# EAGLE design IntelliServo (EAGLE 7.5.0)
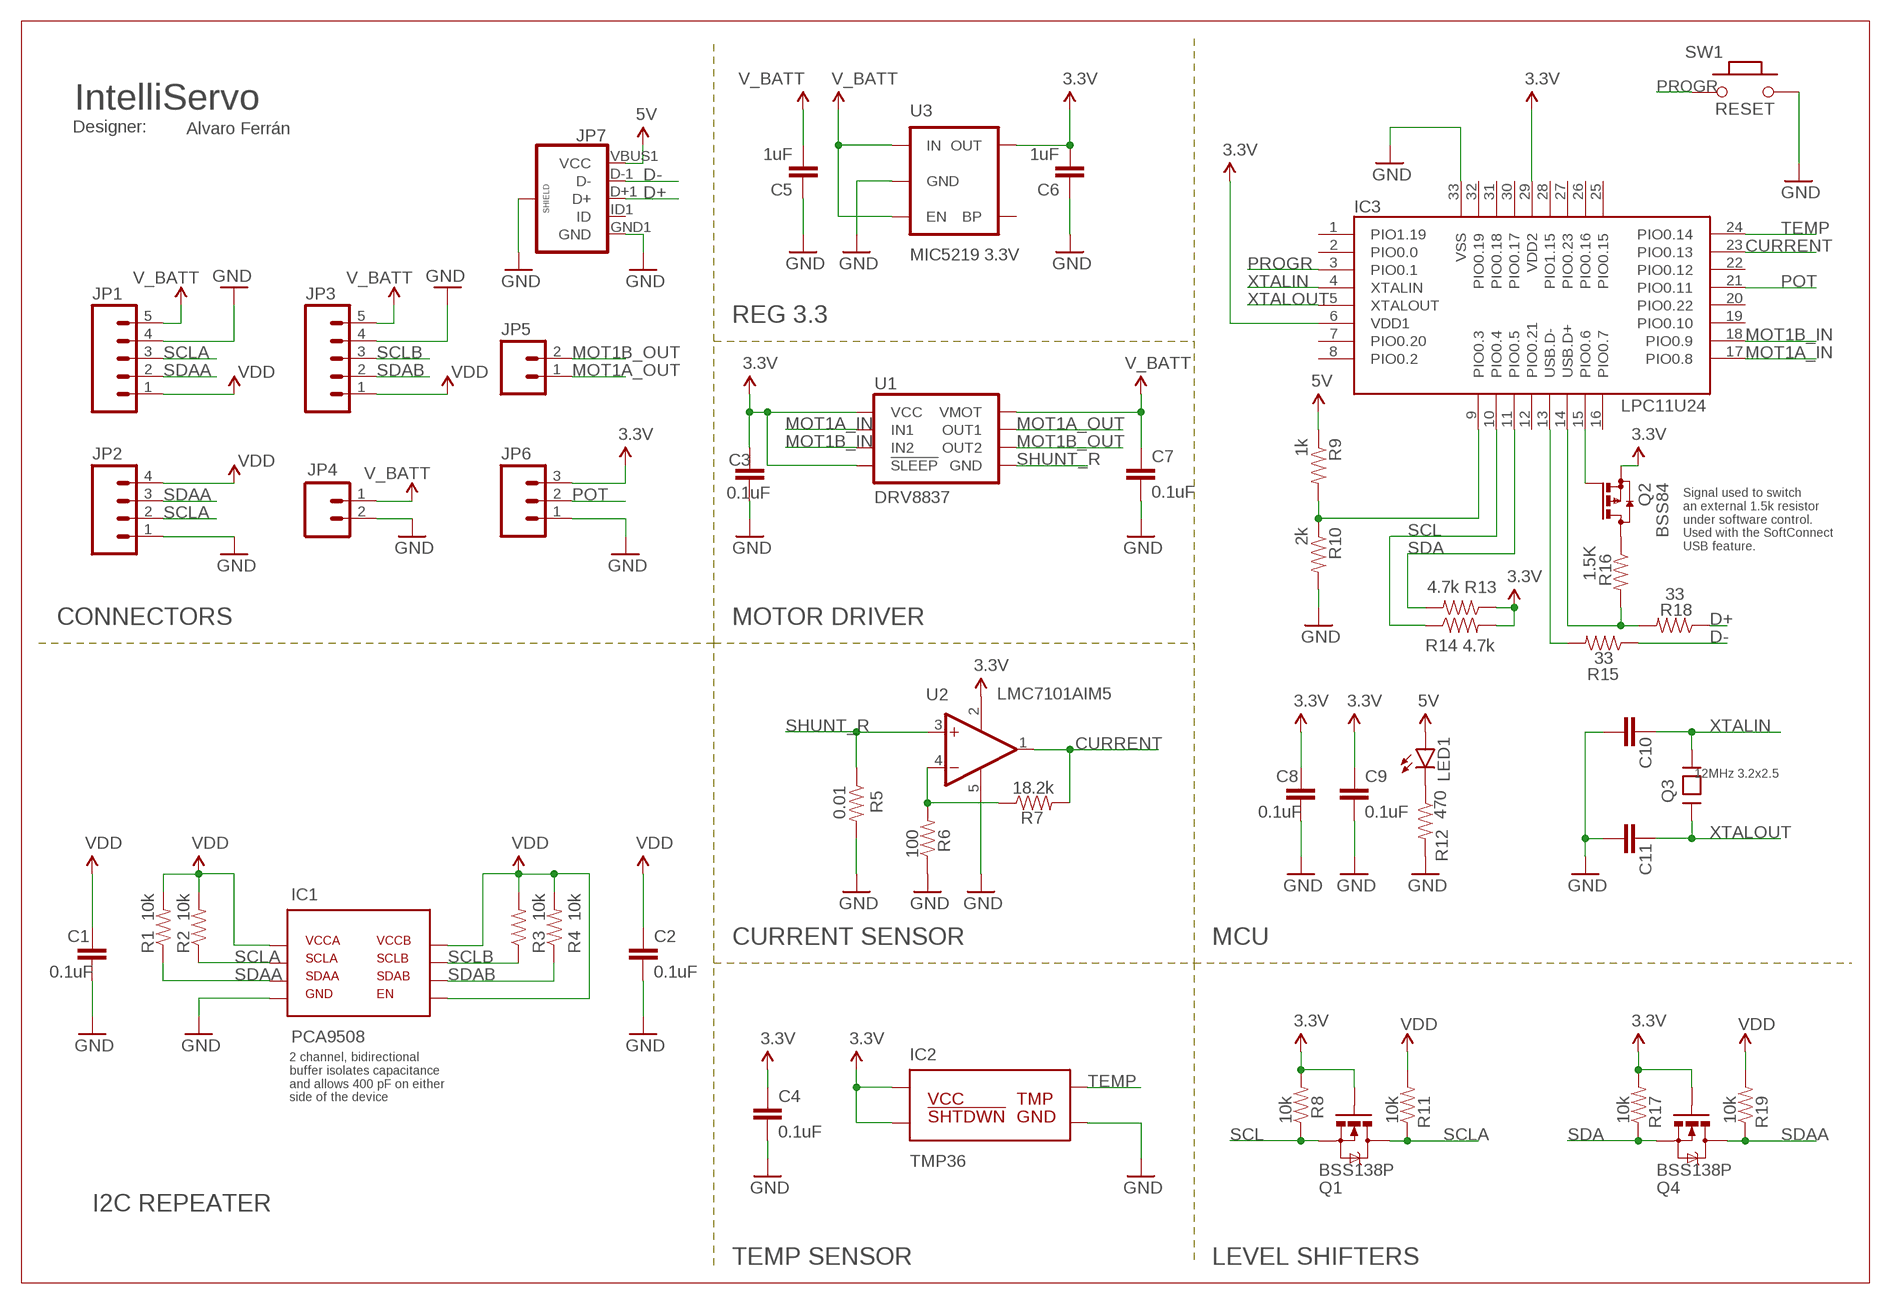
[diagram p0: schematic, sheet 1]

## Parts
C1  0.1uF  CAP0402-CAP  [0402-CAP]
C2  0.1uF  CAP0402-CAP  [0402-CAP]
C3  0.1uF  0.1UF-16V(+-10%)(0402)  [0402-CAP]
C4  0.1uF  CAP0402-CAP  [0402-CAP]
C5  1uF  CAP0402-CAP  [0402-CAP]
C6  1uF  CAP0402-CAP  [0402-CAP]
C7  0.1uF  0.1UF-16V(+-10%)(0402)  [0402-CAP]
C8  0.1uF  CAP0402-CAP  [0402-CAP]
C9  0.1uF  CAP0402-CAP  [0402-CAP]
C10  27pF  CAP0402-CAP  [0402-CAP]
C11  27pF  CAP0402-CAP  [0402-CAP]
IC1  PCA9508  [TSSOP8]
IC2  TMP36  [SOT23-5]
IC3  LPC11U24  LPC11U2X_HVQFN33(5X5)  [HVQFN33_5X5MM]
JP1  M05LOCK  [1X05_LOCK]
JP2  M04LOCK  [1X04_LOCK]
JP3  M05LOCK  [1X05_LOCK]
JP4  M02LOCK  [1X02_LOCK]
JP5  M02LOCK  [1X02_LOCK]
JP6  M03LOCK  [1X03_LOCK]
JP7  USB_MICROB  USB_MICROB_PLUGCONN-11752  [USB-B-MICRO-SMD_V03]
LED1  LED0603  [LED-0603]
Q1  BSS138P  MOSFET-NCHANNELBSS138  [SOT23-3]
Q2  BSS84  [SOT23]
Q3  12MHz 3.2x2.5  CRYSTAL3.2X2.5  [CRYSTAL_3.2X2.5]
Q4  BSS138P  MOSFET-NCHANNELBSS138  [SOT23-3]
R1  10k  RESISTOR0402-RES  [0402-RES]
R2  10k  RESISTOR0402-RES  [0402-RES]
R3  10k  RESISTOR0402-RES  [0402-RES]
R4  10k  RESISTOR0402-RES  [0402-RES]
R5  0.01  RESISTOR0805-RES  [0805]
R6  100  RESISTOR0402-RES  [0402-RES]
R7  18.2k  RESISTOR0402-RES  [0402-RES]
R8  10k  RESISTOR0402-RES  [0402-RES]
R9  1k  RESISTOR0402-RES  [0402-RES]
R10  2k  RESISTOR0402-RES  [0402-RES]
R11  10k  RESISTOR0402-RES  [0402-RES]
R12  470  RESISTOR0402-RES  [0402-RES]
R13  4.7k  RESISTOR0402-RES  [0402-RES]
R14  4.7k  RESISTOR0402-RES  [0402-RES]
R15  33  RESISTOR0402-RES  [0402-RES]
R16  1.5K  RESISTOR0402-RES  [0402-RES]
R17  10k  RESISTOR0402-RES  [0402-RES]
R18  33  RESISTOR0402-RES  [0402-RES]
R19  10k  RESISTOR0402-RES  [0402-RES]
SW1  RESET  PB157  [157SW]
U1  DRV8837  [DSG]
U2  LMC7101AIM5  [SOT23-5]
U3  MIC5219 3.3V  V_REG_MIC52193.3V  [SOT23-5]

## Nets
3.3V: C3.1 C4.1 C6.2 C8.1 C9.1 IC2.2(VCC) IC2.4(!SHTDWN) IC3.6(VDD1) IC3.29(VDD2) JP6.3 Q1.1(G) Q2.2(S) Q4.1(G) R8.2 R13.1 R14.2 R17.2 U1.7(!SLEEP) U1.8(VCC) U2.2(V+) U3.5(OUT)
5V: JP7.VBUS1(VCC) LED1.A R9.1
CURRENT: IC3.23(PIO0.13) R7.2 U2.1(OUT)
D+: JP7.D+1(D+) R18.1
D-: JP7.D-1(D-) R15.1
GND: C1.2 C2.2 C3.2 C4.2 C5.1 C6.1 C7.2 C8.2 C9.2 C10.2 C11.2 IC1.4(GND) IC2.5(GND) IC3.33(VSS) JP1.4 JP2.1 JP3.4 JP4.2 JP6.1 JP7.GND1(GND) JP7.SHIELD1(SHIELD) JP7.SHIELD2(SHIELD) JP7.SHIELD3(SHIELD) R5.2 R6.1 R10.2 R12.2 SW1.2 U2.5(V-) U3.2(GND)
MOT1A_IN: IC3.17(PIO0.8) U1.6(IN1)
MOT1A_OUT: JP5.1 U1.2(OUT1)
MOT1B_IN: IC3.18(PIO0.9) U1.5(IN2)
MOT1B_OUT: JP5.2 U1.3(OUT2)
N$2: LED1.C R12.1
N$4: R6.2 R7.1 U2.4(-IN)
N$27: IC3.14(USB.D+) R16.2 R18.2
N$29: IC3.13(USB.D-) R15.2
N$30: Q2.3(D) R16.1
N$31: IC3.15(PIO0.6) Q2.1(G)
P0.3/ISP_COMMAND_USB_HIGH: IC3.9(PIO0.3) R9.2 R10.1
POT: IC3.21(PIO0.11) JP6.2
PROGR: IC3.3(PIO0.1) SW1.1
SCL: IC3.10(PIO0.4) Q1.2(S) R8.1 R14.1
SCLA: IC1.2(SCLA) JP1.3 JP2.2 Q1.3(D) R2.1 R11.1
SCLB: IC1.7(SCLB) JP3.3 R3.1
SDA: IC3.11(PIO0.5) Q4.2(S) R13.2 R17.1
SDAA: IC1.3(SDAA) JP1.2 JP2.3 Q4.3(D) R1.1 R19.1
SDAB: IC1.6(SDAB) JP3.2 R4.1
SHUNT_R: R5.1 U1.4(GND) U1.PAD(GND) U2.3(+IN)
TEMP: IC2.1(TMP) IC3.24(PIO0.14)
V_BATT: C5.2 C7.1 JP1.5 JP3.5 JP4.1 U1.1(VMOT) U3.1(IN) U3.3(EN)
VDD: C1.1 C2.1 IC1.1(VCCA) IC1.5(EN) IC1.8(VCCB) JP1.1 JP2.4 JP3.1 R1.2 R2.2 R3.2 R4.2 R11.2 R19.2
XTALIN: C10.1 IC3.4(XTALIN) Q3.3
XTALOUT: C11.1 IC3.5(XTALOUT) Q3.1
Unconnected: IC3.1(PIO1.19) IC3.2(PIO0.0) IC3.7(PIO0.20) IC3.8(PIO0.2) IC3.12(PIO0.21) IC3.16(PIO0.7) IC3.19(PIO0.10) IC3.20(PIO0.22) IC3.22(PIO0.12) IC3.25(PIO0.15) IC3.26(PIO0.16) IC3.27(PIO0.23) IC3.28(PIO1.15) IC3.30(PIO0.17) IC3.31(PIO0.18) IC3.32(PIO0.19) JP7.ID1(ID) U3.4(BP)

## Notes on the sheet
- IntelliServo
- Designer: | Alvaro Ferrán
- REG 3.3
- Signal used to switch
  an external 1.5k resistor
  under software control.
  Used with the SoftConnect
  USB feature.
- CONNECTORS | MOTOR DRIVER
- IC1
- CURRENT SENSOR | MCU
- PCA9508
- IC2
- 2 channel, bidirectional
  buffer isolates capacitance
  and allows 400 pF on either
  side of the device
- TMP36
- I2C REPEATER
- TEMP SENSOR | LEVEL SHIFTERS

## Library data of the parts
C1 C2 C4-C6 C8-C11 = SparkFun-Passives:CAP: Capacitor Standard 0603 ceramic capacitor, and 0.1" leaded capacitor.
C3 C7 = SparkFun-Capacitors:0.1UF-16V(+-10%)(0402); PROD_ID: CAP-12416
IC1 = alvaroferran:PCA9508: Level translating I2C-bus repeater. Connects A to B side, in regular i2c bus length intervals, indefinetely.
IC2 = alvaroferran:TMP36
IC3 = GHI-SoMs-Processors:LPC11U2X_HVQFN33(5X5)
JP1 JP3 = SparkFun-Connectors:M05: Header 5 Standard 5-pin 0.1" header. Use with straight break away headers (SKU : PRT-00116), right angle break away headers (PRT-00553), swiss pins (PRT-00743), machine pins (PRT-00117), and female headers (PRT-00115). Molex polarized connector foot print use with SKU : PRT-08230 with associated crimp pins and housings.
JP2 = SparkFun-Connectors:M04: Header 4 Standard 4-pin 0.1" header. Use with straight break away headers (SKU : PRT-00116), right angle break away headers (PRT-00553), swiss pins (PRT-00743), machine pins (PRT-00117), and female headers (PRT-00115). Molex polarized connector foot print use with SKU : PRT-08231 with associated crimp pins and housings. 1MM SMD Version SKU: PRT-10208
JP4 JP5 = SparkFun-Connectors:M02: Standard 2-pin 0.1" header. Use with - straight break away headers ( PRT-00116) - right angle break away headers (PRT-00553) - swiss pins (PRT-00743) - machine pins (PRT-00117) - female headers (PRT-00115) Molex polarized connector foot print use with: PRT-08233 with associated crimp pins and housings. 2.54_SCREWTERM for use with PRT-10571. 3.5mm Screw Terminal footprints for PRT-08084 5mm Screw Terminal footprints for use with PRT-08432
JP6 = SparkFun-Connectors:M03: Header 3 Standard 3-pin 0.1" header. Use with straight break away headers (SKU : PRT-00116), right angle break away headers (PRT-00553), swiss pins (PRT-00743), machine pins (PRT-00117), and female headers (PRT-00115). Molex polarized connector foot print use with SKU : PRT-08232 with associated crimp pins and housings.
JP7 = SparkFun-Connectors:USB_MICROB_PLUG: USB Micro-B connectors Some male, some female. Watch your step!; PROD_ID: CONN-11752
LED1 = SparkFun-LED:LED: LEDs Standard schematic elements and footprints for 5mm, 3mm, 1206, and 0603 sized LEDs. 5mm - Spark Fun Electronics SKU : COM-00529 (and others)
Q1 Q4 = SparkFun-DiscreteSemi:MOSFET-NCHANNEL: Common NMOSFET Parts MFG P/N Store ID Prod ID FDD8780 TRANS-09984 SI7820DN TRANS-11055 FDS6630A IC-08089 2N7002PW TRANS-11151 FQP30N06L COM-10213 TRANS-10060 BSS123LT1G TRANS-08345 BSS138 TRANS-00830 BS170 2N7000; PROD_ID: TRANS-00830; VALUE: 200mA/50V
Q2 = transistor-small-signal:BSS84: P-CHANNEL MOS FET
Q3 = GHI:CRYSTAL3.2X2.5
R1-R19 = SparkFun-Passives:RESISTOR: Resistor Basic schematic elements and footprints for 0603, 1206, and PTH resistors.
SW1 = MySMD:PB157
U1 = packages(ti):DRV8837
U2 = linear:LMC7101AIM5
U3 = SparkFun-PowerIC:V_REG_MIC5219: V_REG MIC5219 Standard 3.3V and 5V 500mA LDO voltage regulator in SOT-23 layout. Micrel part MIC5219. BP (by-pass) pin is used to lower output noise with 470pF cap, may be left open.; PROD_ID: VREG-09872

## Net classes
0 default: width 0.254 mm, drill 0.254 mm, clearance 0.203 mm

## Board
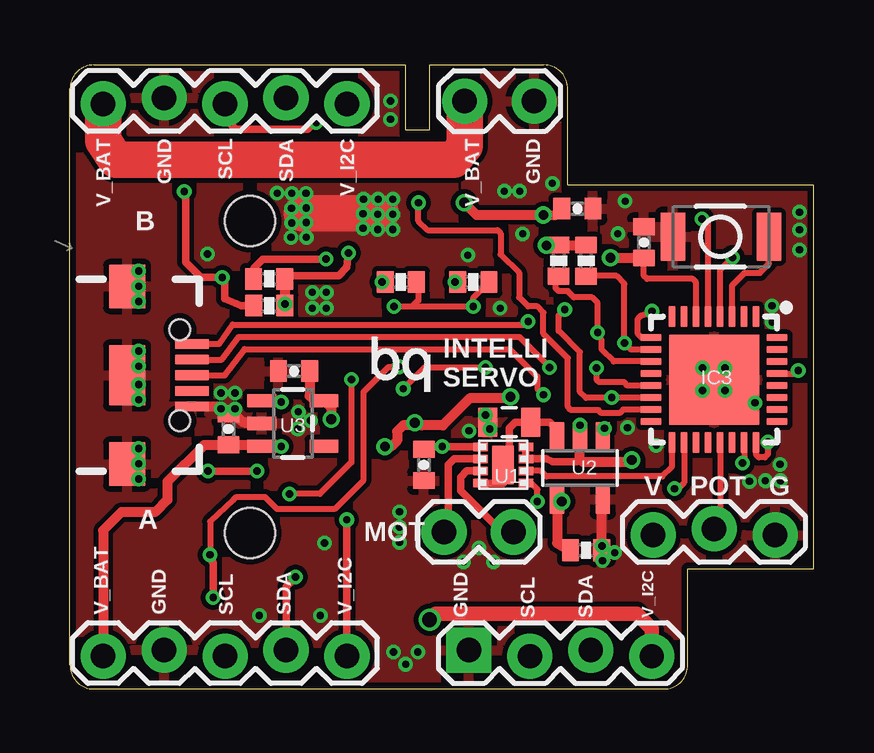
[diagram p1: board, top side]
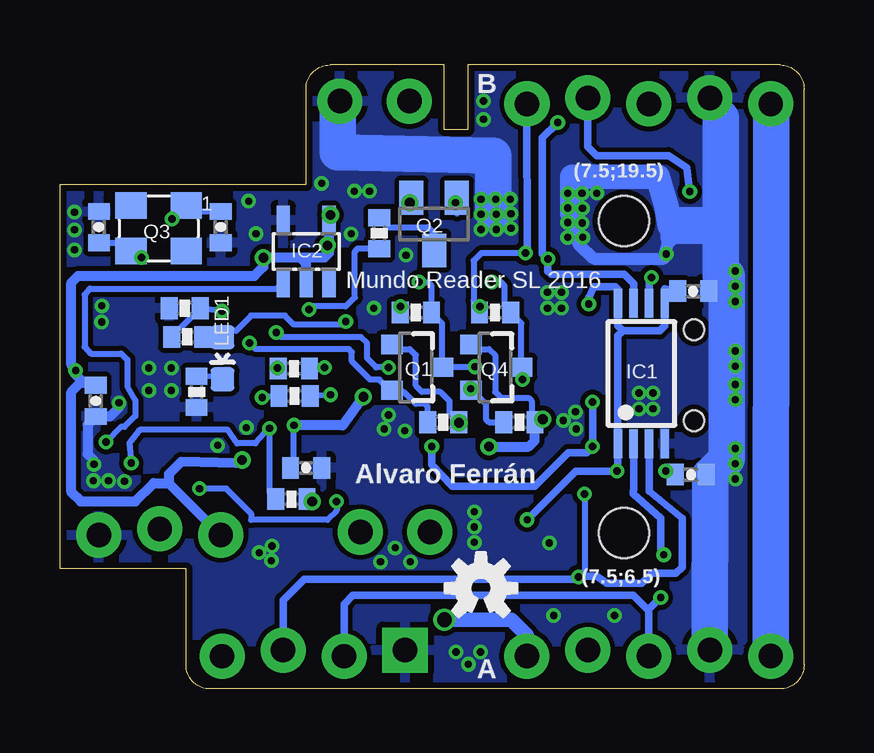
[diagram p2: board, bottom side, seen from below]

Size 31 x 26 mm. Coordinates in mm from the lower left corner, seen from the top.
Outline: 1,0 24.75,0 arc90 25.75,1 25.75,5 31,5 31,21 20.75,21 20.75,25 arc90 19.75,26 15,26 15,23.3 14,23.3 14,26 1,26 arc90 0,25 0,1 arc90 1,0
Copper layers (1*16): Top 0.035mm / dielectric 1.5mm / Bottom 0.035mm
Design rules "pighixxx_CAM_DRC_V1.0": minimum track width 6mil, minimum drill 12mil, track to track 6mil, track to pad 6mil, pad to pad 6mil, via to via 6mil, smd to smd 0mil, copper to edge 10mil, drill to drill 10mil, minimum pad ring 10mil, minimum via ring 6mil, stop-mask expansion 2mil, vias tented up to drill 100mil, thermal gap 10mil
Holes 2.1 mm at 7.5,19.5 7.5,6.5

### Footprints (pad centres in the part's own frame; a part is rotated, then mirrored left to right if it is on the bottom)
0402-CAP = smd 0.7 x 0.9: 1 -0.65,0; 2 0.65,0
TSSOP8 = smd 1.2 x 0.35: 1 -2.925,0.975; 2 -2.925,0.325; 3 -2.925,-0.325; 4 -2.925,-0.975; 5 2.925,-0.975; 6 2.925,-0.325; 7 2.925,0.325; 8 2.925,0.975
SOT23-5 = smd 0.55 x 1.2: 1 -0.95,-1.3; 2 0,-1.3; 3 0.95,-1.3; 4 0.95,1.3; 5 -0.95,1.3
HVQFN33_5X5MM = smd 0.85 x 0.27: 1 -2.625,1.75; 2 -2.625,1.25; 3 -2.625,0.75; 4 -2.625,0.25; 5 -2.625,-0.25; 6 -2.625,-0.75; 7 -2.625,-1.25; 8 -2.625,-1.75; 17 2.625,-1.75; 18 2.625,-1.25; 19 2.625,-0.75; 20 2.625,-0.25; 21 2.625,0.25; 22 2.625,0.75; 23 2.625,1.25; 24 2.625,1.75 | smd 0.27 x 0.85: 9 -1.75,-2.625; 10 -1.25,-2.625; 11 -0.75,-2.625; 12 -0.25,-2.625; 13 0.25,-2.625; 14 0.75,-2.625; 15 1.25,-2.625; 16 1.75,-2.625; 25 1.75,2.625; 26 1.25,2.625; 27 0.75,2.625; 28 0.25,2.625; 29 -0.25,2.625; 30 -0.75,2.625; 31 -1.25,2.625; 32 -1.75,2.625 | smd 3.75 x 3.75: 33 0,0
1X05_LOCK = drill 1.016 pad 1.88: 1 0,0.127; 2 2.54,-0.127; 3 5.08,0.127; 4 7.62,-0.127; 5 10.16,0.127
1X04_LOCK = drill 1.016 pad 1.88 square: 1 0,0.127 | drill 1.016 pad 1.88: 2 2.54,-0.127; 3 5.08,0.127; 4 7.62,-0.127
1X02_LOCK = drill 1.016 pad 1.88: 1 -0.178,0; 2 2.718,0
1X03_LOCK = drill 1.016 pad 1.88: 1 0,0.127; 2 2.54,-0.127; 3 5.08,0.127
USB-B-MICRO-SMD_V03 = smd 1.4 x 0.4: D+1 2.7,0; D-1 2.7,0.65; GND1 2.7,-1.3; ID1 2.7,-0.65; VBUS1 2.7,1.3 | smd 1.5 x 1.8: SHIELD1 0,3.7; SHIELD2 0,-3.7 | smd 1.5 x 2.5: SHIELD3 0,0 | hole 0.85: 2.2,1.9; 2.2,-1.9
LED-0603 = smd 1 x 1: A 0,-0.877; C 0,0.877
SOT23-3 = smd 0.8 x 0.9: 1 -0.95,-1; 2 0.95,-1; 3 0,1.1
SOT23 = smd 1 x 1.4: 1 -0.95,-1.1; 2 0.95,-1.1; 3 0,1.1
CRYSTAL_3.2X2.5 = smd 1.3 x 1.1: 1 -1.1,-0.9; 2 1.2,-0.9; 3 1.2,1; 4 -1.1,1
0402-RES = smd 0.7 x 0.9: 1 -0.65,0; 2 0.65,0
0805 = smd 0.8 x 1.2: 1 -0.9,0; 2 0.9,0
157SW = smd 1.016 x 1.981: 1 0,0; 2 4,0
DSG = smd 0.6 x 0.35: 1 -0.95,0.75; 2 -0.95,0.25; 3 -0.95,-0.25; 4 -0.95,-0.75; 5 0.95,-0.75; 6 0.95,-0.25; 7 0.95,0.25; 8 0.95,0.75 | smd 0.9 x 1.6: PAD 0,0
SOT23-5' = smd 0.6 x 1.2: 1 -0.95,-1.306; 2 0,-1.306; 3 0.95,-1.306; 4 0.95,1.306; 5 -0.95,1.306

### Placement (x,y rotation side)
C1  4.62,16.57 0 bottom
C2  4.72,8.93 0 bottom
C3  20.75,9.21 0 bottom
C4  21.15,20.01 0 top
C5  6.6,10.82 270 top
C6  9.34,13.25 0 top
C7  14.75,9.33 270 top
C8  23.92,18.61 90 top
C9  29.51,12 270 bottom
C10  29.38,19.24 90 bottom
C11  24.3,19.24 270 bottom
IC1  6.78,13.14 90 bottom
IC2  20.75,18.22 0 bottom
IC3  26.84,12.89 270 top
JP1  11.54,1.5 180 top
JP2  16.62,1.49 0 top
JP3  11.54,24.5 180 top
JP4  16.62,24.49 0 top
JP5  15.77,6.54 0 top
JP6  29.38,6.54 180 top
JP7  2.38,13.07 0 top
LED1  24.23,13.78 180 bottom
Q1  16.17,13.4 270 bottom
Q2  15.41,19.37 180 bottom
Q3  26.84,19.24 180 bottom
Q4  12.87,13.4 270 bottom
R1  13.79,16.95 0 top
R2  16.81,16.95 0 top
R3  8.3,17.08 0 top
R4  8.31,15.97 0 top
R5  18.31,11.11 180 top
R6  21.51,5.78 180 top
R7  21.36,7.91 180 bottom
R8  15.03,11.11 0 bottom
R9  25.7,14.67 180 bottom
R10  25.8,15.86 180 bottom
R11  16.17,15.68 180 bottom
R12  25.31,12.38 270 bottom
R13  20.36,17.84 270 top
R14  21.51,17.84 90 top
R15  21.25,13.35 180 bottom
R16  17.7,18.99 270 bottom
R17  11.86,11.11 0 bottom
R18  21.23,12.2 180 bottom
R19  12.87,15.68 180 bottom
SW1  29.13,18.84 180 top
U1  18.05,9.33 0 top
U2  LMC7101AIM5  [SOT23-5']  21.25,9.21 180 top
U3  9.29,11.06 270 top
U$1  [BQ_LOGO_SMALL_1]  13.76,12.89 0 top
U$2  [OSHW-LOGO-S]  13.46,4.19 0 bottom

### Tracks (layer width: path | path; a pad name or v marks a point on that pad's centre or on a via)
3.3V  (via drill 0.3, 0.41)
  Top 0.254: IC3.6 26.09,16.94 25.95,17.08 24.05,17.08 23.92,17.21 C8.1 | v14.37,11.09 14.47,10.98 14.65,10.98 | IC3.29 30.27,13.14 v30.35,13.27
  Top 0.305: U1.8 U1.7 19.86,9.59 20.11,9.46 21.13,9.46 21.25,9.59 21.38,9.46
  Top 0.406: C6.2 9.99,12.21 10.22,11.99 U3.5 | 21.38,9.46 23.16,9.46 v23.41,9.54 | v21.25,10.98 U2.2 21.25,9.59 | 10.63,12 U3.5 | v18.36,12.18 18.2,12.13 16.68,12.13 15.54,10.98 14.65,10.98 13.89,10.98 13.63,10.73 13.63,10.35 13.38,10.1 v13.12,10.1 | U3.5 10.89,11.71 v10.89,11.24 | v22.52,17.97 22.54,17.95 C8.1 | C4.1 20.23,19.74 v19.73,19.75 16.93,19.75 v16.43,20.26 | R14.2 R13.1 v19.86,18.48
  Bottom 0.254: 16.98,14.16 16.43,14.16 16.17,13.91 16.17,12.64 15.92,12.38 15.16,12.38 14.78,12 14.78,11.51 R8.2 | 13.68,14.16 13.12,14.16 12.87,13.91 12.87,12.38 12.62,12.13 11.47,12.13 11.35,12 11.35,11.25 R17.2 | v30.35,13.27 30.5,13.27 30.52,13.5 | Q2.2 16.43,20.4 v16.43,20.26 | C3.1 21.25,9.35 v21.25,10.98
  Bottom 0.406: Q1.1 16.98,14.16 | Q4.1 13.68,14.16 | v23.41,9.54 23.67,9.41 25.95,9.46 26.46,8.95 26.46,8.57 | JP6.3 26.46,8.57 | v18.36,12.18 19.22,10.98 v21.25,10.98 | v10.89,11.24 11.02,11.11 R17.2 11.22,11.1 11.22,10.35 11.47,10.1 v13.12,10.1 | v14.37,11.09 R8.2 | IC2.2 20.75,17.72 21,17.97 | 21,17.97 v22.52,17.97 22.52,17.59 22.9,17.21 30.25,17.21 30.52,16.93 30.52,13.5 v30.35,13.27 30.4,13.14 30.02,12.76 29.4,12.76 C9.1 30.13,12.78 30.52,12.38 30.52,8.19 30.14,7.81 27.86,7.81 27.09,8.57 26.46,8.57 | 19.8,18.73 IC2.4 19.8,19.68 v19.73,19.75 | 19.8,18.73 19.8,18.16 19.98,17.97 21,17.97 | v19.86,18.48 19.8,18.73
5V  (via drill 0.3)
  Top 0.254: JP7.VBUS1 6.22,14.37 6.78,15.18 18.97,15.18 v19.09,15.3
  Bottom 0.254: v19.09,15.3 19.22,15.18 21.25,15.18 21.63,15.56 23.03,15.56 23.67,14.92 24.68,14.92 25.19,14.41 R9.1 24.95,14.41 LED1.A
CURRENT  (via drill 0.3)
  Top 0.254: IC3.23 28.09,9.61 28.11,9.59 v28.03,9.42
  Top 0.406: v22.27,10.86 22.27,10.45 U2.1
  Bottom 0.254: R7.2 22.27,8.18 v22.27,10.86 22.46,10.67 22.86,10.24 23.62,10.24 24,10.79 27.69,10.79 28.11,10.24 v28.03,9.42
D+  (via drill 0.3)
  Top 0.254: JP7.D+1 6.45,13.07 7.28,14.16 18.33,14.16 19.48,13.02 19.48,12.51 v19.73,12.26
  Bottom 0.254: v19.73,12.26 R18.1
D-  (via drill 0.3)
  Top 0.254: JP7.D-1 6.33,13.72 7.03,14.67 18.71,14.67 v19.98,13.4
  Bottom 0.254: v19.98,13.4 R15.1
GND  (via drill 0.3)
  Top 0.305: v17.49,10.83 17.49,11.03 R5.2 | v6.88,11.67 6.72,11.57 C5.1
  Top 0.406: R6.1 22.16,7.86 U2.5 | U3.2 7.49,11.06 arc-90 v6.88,11.67 | JP7.GND1 6.2,11.77 arc-90 v6.29,11.67 | v27.3,12.43 27.81,11.92 v28.54,11.92
  Top 1.524: 12.95,19.81 9.65,19.81
  Bottom 0.406: v29.59,9.36 29.59,9.52 29.84,9.78 29.84,11.02 C9.2 28.91,11.35 28.54,11.72 v28.54,11.92
  Bottom 0.508: 9.65,19.43 9.4,18.54 8.76,17.93 5.83,17.93 5.59,18.8
  Bottom 0.762: 5.59,18.8 5.59,18.92 4.19,18.92 4.19,19.68 5.33,19.68
  Bottom 1.016: 9.65,21.34 6.1,21.34 5.71,20.07 5.59,19.3 | 9.65,19.81 9.65,21.21
  Bottom 1.27: 3.22,17.21 3.47,17.21 | 3.47,23.8 JP3.4
  Bottom 1.524: JP1.4 3.9,8.9 3.22,9.59 3.22,17.21 | 3.47,17.21 3.47,23.8 | 12.95,19.81 12.95,22.23 19.43,22.35 19.43,24.51
  other vias: 26.36,13.37 27.3,13.37 26.36,12.43 6.29,12.33 6.88,12.33 22.17,5.96 17.04,5.88 10.61,6.08 13.74,6.11 13.74,7.38 13.74,6.74 9.52,11.54 10.03,11.19 9.49,10.83 10.1,15.86 10.1,16.52 10.69,16.52 10.69,15.86 18.1,20.74 18.74,20.74 20.1,21.07 23.14,20.32 22.83,18.97 30.4,19.87 29.26,15.29 29.25,15.96 30.4,19.13 30.4,18.3 18.87,18.96 16.58,18.07 29.61,8.67 28.98,8.67 28.31,8.65 13.35,23.74 13.35,24.5 14.5,1.54 13.48,1.54 13.99,1.03 10.43,3.06 7.89,3.06 17.32,11.42 16.63,10.76 22.19,5.35 22.7,5.68 16.4,5.3 17.65,5.3 2.86,16.14 2.86,16.78 2.86,17.41 2.86,10.02 2.86,9.38 2.86,8.75 2.86,12.05 2.86,12.69 2.86,13.45 2.86,14.08 24.43,10.15 23.23,10.88 8.63,20.66 17.93,15.86 12.24,20.41 12.85,20.41 13.46,20.41 12.21,19.8 12.21,19.19 12.82,19.77 13.46,19.77 13.46,19.14 12.82,19.14 9.25,20.65 9.84,20.65 9.84,20.04 9.84,19.43 9.23,20.02 9.24,19.41 9.21,18.82 5.73,18.12 9.85,18.82
  pour Bottom: -1.1,26.53 32.18,26.53 32.18,-1.01 -1.1,-1.01
  pour Top: -0.84,27.03 32.43,27.03 32.43,-1.51 -0.84,-1.51
MOT1A_IN
  Top 0.254: IC3.17 25.09,9.26 24.68,8.85 19.86,8.85 19.62,9.08 U1.6
MOT1A_OUT
  Top 0.305: U1.2 16.02,9.59 15.77,9.33 15.77,6.72 JP5.1
MOT1B_IN  (via drill 0.3)
  Top 0.254: IC3.18 25.59,8.59 25.34,8.34 v25.19,8.34 | v19.48,7.81 19.48,8.32 19.21,8.58 U1.5
  Bottom 0.254: v25.19,8.34 24.07,8.34 23.03,7.3 23.03,7.05 19.86,7.05 19.48,7.43 v19.48,7.81
MOT1B_OUT
  Top 0.305: U1.3 16.53,9.08 16.27,8.83 16.27,8.27 18,6.54 JP5.2
N$2
  Bottom 0.254: LED1.C 24.34,13.02 R12.1
N$4  (via drill 0.41)
  Top 0.406: R6.2 20.3,6.08 U2.4 20.39,7.81 v20.49,7.81
  Bottom 0.406: v20.49,7.81 20.6,7.81 R7.1
N$27  (via drill 0.3)
  Top 0.254: IC3.14 v22.58,12.14 22.66,12.13 21.51,12.13 21.25,12.38 21.25,14.03 20.36,14.92 20.36,15.56 v20.62,15.81
  Bottom 0.254: v22.58,12.14 22.51,12.2 R18.2 21.88,12.37 | R16.2 17.71,18.35 18.59,18.35 18.71,18.22 18.71,16.32 19.09,15.94 20.49,15.94 v20.62,15.81
N$29  (via drill 0.3)
  Top 0.254: IC3.13 23.23,12.64 23.08,12.79 22.04,12.79 21.94,12.89 v21.94,13.37
  Bottom 0.254: v21.94,13.37 21.84,13.47 R15.2
N$30
  Bottom 0.254: R16.1 17.3,19.24 15.66,19.24 15.41,18.99 Q2.3
N$31  (via drill 0.3)
  Top 0.254: IC3.15 23.05,11.64 22.9,11.49 22.14,11.49 22.02,11.62 20.87,11.62 20.75,11.75 20.75,13.78 19.73,14.79 19.73,15.68 19.48,15.94 19.09,15.94 18.71,16.32 18.71,17.34 17.95,18.1 17.95,18.99 17.82,19.11 14.9,19.11 14.52,19.49 v14.52,20.26
  Bottom 0.254: Q2.1 14.46,19.81 v14.52,20.26 14.52,20
P0.3/ISP_COMMAND_USB_HIGH  (via drill 0.3)
  Top 0.254: IC3.9 23.82,14.64 23.67,14.79 23.67,15.43 23.79,15.56 v24.25,15.73
  Bottom 0.254: R9.2 R10.1 v24.25,15.73
POT
  Top 0.254: IC3.21 27.09,6.92 JP6.2
PROGR
  Top 0.254: IC3.3 27.59,16.82 28.11,17.34 28.75,17.34 29.13,17.72 SW1.1
SCL  (via drill 0.3)
  Top 0.254: IC3.10 23.38,14.14 v23.11,14.41 23.11,16.88 22.78,17.21 21.52,17.21 R14.1
  Bottom 0.254: R8.1 15.68,11.76 15.79,11.87 16.17,11.87 16.68,12.38 17.11,12.38 Q1.2 17.25,12.45 17.7,12.89 18.08,12.89 18.84,13.65 18.84,14.03 18.97,14.16 22.85,14.16 v23.11,14.41
SCLA  (via drill 0.3)
  Top 0.254: v13.71,13.42 13.28,13.42 12.24,12.38 12.24,8.7 11.03,7.49 8.64,7.49 8.13,8 6.93,8 6.81,7.87 5.84,6.99 v5.84,5.59
  Top 0.305: v5.84,5.59 5.97,5.21 v5.97,3.81
  Top 0.406: v16.05,16.95 R2.1
  Bottom 0.254: v13.71,13.42 13.63,13.4 Q1.3 15.07,15.23 R11.1 15.54,15.7 15.54,16.83 15.66,16.95 v16.05,16.95
  Bottom 0.305: IC1.2 7.1,8.39 7.11,8.13 5.97,7.11 5.97,5.84 v5.84,5.59 | JP2.2 19.16,3.53 18.8,3.9 7.11,3.9 6.46,3.25 | 6.46,3.25 JP1.3 | v5.97,3.81 6.46,3.31 6.46,3.25
SCLB  (via drill 0.3)
  Top 0.305: JP3.3 6.46,23.76 6.91,23.32 9.91,23.32 10.19,23.6 v10.26,23.6 10.26,23.47 | R3.1 7.67,17.54 8.04,17.91 v10.67,17.91
  Bottom 0.305: v10.26,23.6 10.9,22.96 10.9,18.14 v10.67,17.91 10.67,17.4 10.54,17.27 7.49,17.27 7.1,16.88 IC1.7
SDA  (via drill 0.3)
  Top 0.254: v13.89,12.51 14.78,13.4 v17.32,13.4 | IC3.11 24.2,13.65 22.65,13.65 22.14,14.16 22.14,14.54 v21.99,14.85 21.99,16.09 21.76,16.32 21,16.32 20.75,16.57 20.36,16.57 20.24,16.7 20.24,17.07 R13.2
  Bottom 0.254: v13.89,12.51 13.87,12.49 Q4.2 13.83,12.45 13.25,11.87 13.25,11.24 13.12,11.11 R17.1 | v17.32,13.4 17.82,13.4 18.2,13.78 18.2,14.41 18.46,14.67 21.81,14.67 v21.99,14.85
SDAA  (via drill 0.3)
  Top 0.254: v11.73,12.89 11.73,9.44 10.41,8.13 v9.14,8.13
  Top 0.305: v9.4,4.66 9.01,4.27 JP1.2
  Top 0.406: v13,16.95 R1.1
  Bottom 0.254: v11.73,12.89 11.77,12.93 Q4.3 11.77,15.23 R19.1 12.49,15.95 12.49,16.83 12.62,16.95 v13,16.95 | v9.14,8.13 9.14,4.91 v9.4,4.66
  Bottom 0.305: IC1.3 6.45,8.23 5.08,7.11 5.08,5.08 5.33,4.83 6.35,4.83 6.77,4.41 8.22,4.41 8.64,4.7 9.23,4.7 v9.4,4.66 9.49,4.57 20.83,4.57 21.7,3.7 JP2.3
SDAB  (via drill 0.3)
  Top 0.305: R4.1 7.14,15.97 6.45,16.26 6.45,17.05 v6.35,17.14 5.46,17.14 4.83,17.78 4.83,20.6 v4.76,20.72
  Bottom 0.305: IC1.6 6.45,17.05 v6.35,17.14 | JP3.2 9,22.59 8.64,22.23 5.64,22.23 4.88,21.72 v4.76,20.72
SHUNT_R
  Top 0.305: U1.4 17.11,8.57 18.05,8.57 U1.PAD 18.05,9.59 18.31,9.84 18.31,10.86 18.56,11.11 R5.1 19.98,11.11 20.24,10.83 U2.3
TEMP  (via drill 0.3)
  Top 0.254: v29.08,10.29 29.08,9.78 28.96,9.65 28.7,9.65 28.59,9.76 IC3.24
  Bottom 0.254: IC2.1 21.97,16.68 29.76,16.68 29.97,16.43 29.97,14.25 29.72,13.97 28.45,13.97 28.19,13.72 28.19,12.6 27.86,12.01 27.86,11.38 28.32,10.92 28.45,10.92 v29.08,10.29
V_BATT  (via drill 0.3)
  Top 0.305: U1.1 16.03,10.08 v15.51,10.1 14.76,10.1 C7.1 | U3.1 8.59,11.99 v8.81,11.95 | v8.81,10.1 8.62,10.16 U3.3 | C5.2 6.86,10.27 6.86,10.16
  Top 0.406: U3.3 7.94,10.16 6.86,10.16 5.59,10.16 4.06,8.64 4.06,7.87 3.56,7.37 2.14,7.37 1.38,6.6 JP1.5
  Top 1.524: JP4.1 16.44,22.63 16,22.06 1.91,22.06 1.38,22.83 JP3.5
  Bottom 0.305: v8.81,11.95 v8.81,10.1 9.06,9.84 9.82,9.84 11.22,8.45 14.65,8.45 15.51,9.33 v15.51,10.1
  Bottom 0.406: JP3.5 1.36,24.36 1.36,24.26
  Bottom 1.524: 1.36,24.26 1.37,22.19 JP1.5
  Bottom 1.778: 1.36,24.43 1.36,24.26
VDD  (via drill 0.3, 0.61)
  Top 0.254: v13.51,15.94 14.27,15.94 | 14.27,15.94 v16.81,15.94 16.81,16.3 R2.2 | 14.52,16.94 14.52,16.19 14.27,15.94
  Top 0.305: v5.76,9.08 v7.79,9.08 | R3.2 9.06,17.22 11.2,17.22 11.54,17.57 v11.6,18.16 | v11.53,7.05 11.54,7.04 JP1.1 | v8.97,16.04 8.96,16.02 R4.2
  Top 0.406: R3.2 R4.2 | 14.52,16.94 R1.2
  Top 0.61: JP2.4 24.24,2.51 23.62,3.14 15.24,3.14 v14.99,2.88
  Bottom 0.254: 11.53,18.16 13.45,18.16 13.76,17.84 13.76,16.19 v13.51,15.94
  Bottom 0.305: C2.1 v5.76,9.08 | C1.1 5.8,16.67 IC1.5 5.8,15.13 6.01,14.92 7.54,14.92 | 7.54,14.92 7.75,15.13 IC1.8 7.75,16.63 7.75,16.64 7.87,16.76 8.76,16.76 8.96,16.32 8.97,16.31 v8.97,16.04 | v11.53,7.05 9.5,9.08 v7.79,9.08 7.75,9.12 IC1.1 7.75,14.71 7.54,14.92 | v11.6,18.16 11.53,18.16 JP3.1
  Bottom 0.406: R19.2 13.52,15.92 v13.51,15.94 | R11.2 16.82,15.92 v16.81,15.94
  Bottom 0.61: v14.99,2.88 12.19,2.88 11.54,2.23 JP1.1
XTALIN  (via drill 0.3)
  Top 0.254: IC3.4 27.09,17.46 v27.6,17.97
  Bottom 0.254: C10.1 28.39,18.59 Q3.3 27.77,17.97 v27.6,17.97
XTALOUT  (via drill 0.3)
  Top 0.254: IC3.5 26.59,19.42 v26.33,19.57
  Bottom 0.254: C11.1 25.49,19.89 Q3.1 26.01,19.88 v26.33,19.57

### Text on the board
tPlace: V_BAT | GND | SCL | SDA | V_I2C | V_BAT | GND | B | INTELLI / SERVO | V | POT | G | A | MOT | V_BAT | GND | SCL | SDA | V_I2C | GND | SCL | SDA | V_I2C
bPlace: B | (7.5;19.5) | Mundo Reader SL 2016 | Alvaro Ferrán | (7.5;6.5) | A